# Altium schematic sheet [1]_Power.SchDoc
size A; SheetNumber: 1; SheetTotal: 3
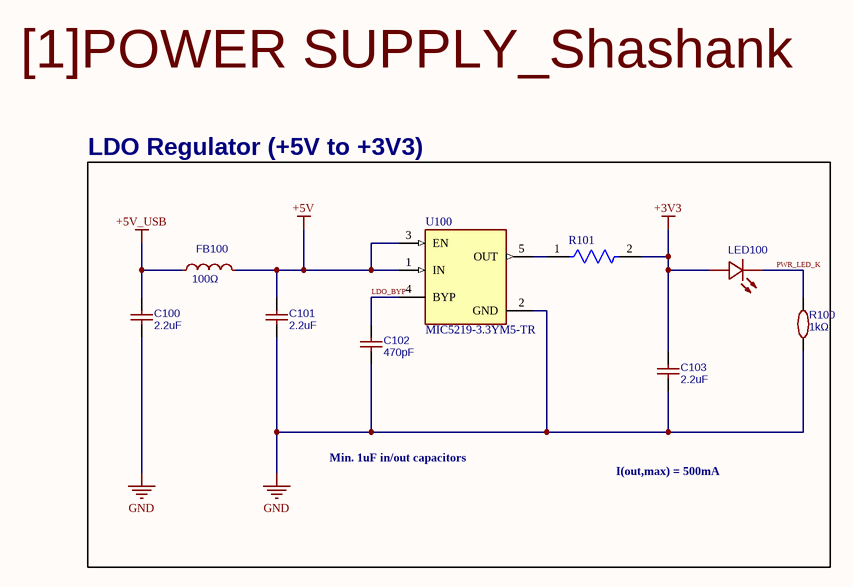
[diagram p0: [1]_Power.SchDoc]

## Parts
C100  2.2uF  [C0603]
C101  2.2uF  [C0603]
C102  470pF  [C0402]
C103  2.2uF  [C0603]
FB100  100Ω  [L0603]
LED100  FC-F1005UGK-520M5  [LED0402-RD]  (value not drawn)
R100  1kΩ  [R0402]
R101  CRCW04020000Z0ED  [FP-CRCW0402-e3-IPC_C]  (value not drawn)
U100  MIC5219-3.3YM5-TR  [FP-SOT23-5LD-PL-1-IPC_C]

## Nets
+3V3: C103.2 LED100.2(A) R101.2
+5V: C101.2 FB100.2 U100.1(IN) U100.3(EN)
+5V_USB: C100.2 FB100.1
GND: C100.1 C101.1 C102.1 C103.1 R100.1 U100.2(GND)
LDO_BYP: C102.2 U100.4(BYP)
PWR_LED_K: LED100.1(K) R100.2
NetR101_1: R101.1 U100.5(OUT)

## Notes on the sheet
- [1]POWER SUPPLY_Shashank
- LDO Regulator (+5V to +3V3)
- Min. 1uF in/out capacitors
- I(out,max) = 500mA

## Library data of the parts
C100 C101 C103 = 2.2uF: Manufacturer Part: CL10A225KO8NNNC; Manufacturer: SAMSUNG(三星); nameAlias: Value; Supplier: LCSC; Supplier Part: C23630; JLCPCB Part Class: Basic Part; link: https://lcsc.com/eda_search?q=C23630&%26type=1&ref=editor; spicePre: C; spiceSymbolName: CL10A225KO8NNNC
C102 = 470pF: Manufacturer: FH(风华); Manufacturer Part: 0402B471K500NT; nameAlias: Value; Supplier: LCSC; Supplier Part: C1537; JLCPCB Part Class: Basic Part; link: https://lcsc.com/eda_search?q=C1537&%26type=1&ref=editor; spicePre: C; spiceSymbolName: 0402B471K500NT
FB100 = 120Ω: Manufacturer: Sunlord(顺络); Manufacturer Part: PZ1608D121-2R0TF; nameAlias: Value; Supplier: LCSC; Supplier Part: C42102; JLCPCB Part Class: Extended Part; spicePre: L; spiceSymbolName: PZ1608D121-2R0TF
LED100 = FC-F1005UGK-520M5: Manufacturer: 国星光电; Manufacturer Part: NCD0402G1; Contributor: LCSC; Supplier: LCSC; Supplier Part: C130723; JLCPCB Part Class: Extended Part; link: https://lcsc.com/eda_search?q=C130723&%26type=1&ref=editor; spicePre: L; spiceSymbolName: FC-F1005UGK-520M5
R100 = 1kΩ: Manufacturer: UNI-ROYAL(厚声); Manufacturer Part: 0402WGF1001TCE; nameAlias: Value; Supplier: LCSC; Supplier Part: C11702; JLCPCB Part Class: Basic Part; link: https://lcsc.com/eda_search?q=C11702&%26type=1&ref=editor; spicePre: R; spiceSymbolName: 0402WGF1001TCE
R101 = CMP-2002-08122-2: RES Thick Film, 0Ω, 0.063W, 0402; Tolerance: 5%; Max Power Dissipation: 63mW; Voltage Rating: 50V; Temperature Coefficient: 100ppm/°C; Resistance: 0mR; Contact Plating: Tin; Height: 0.35mm; Radiation Hardening: No; Features: Automotive AEC-Q200; Composition: Thick Film; Width: 0.5mm; Weight: 2.3E-05oz; Termination: SMD/SMT; Packaging: Tape and Reel; Mount: Surface Mount; Case Code (Metric): 1005; Military Standard: Not; Min Operating Temperature: -55°C; Number of Terminations: 2; Package Quantity: 1; Case Code (Imperial): 0402; Depth: 0.5mm; Max Operating Temperature: 155°C; Case/Package: 0402; Power Rating: 63mW; Lead Free: Lead Free; Voltage Rating (DC): 50V; Length: 1mm
U100 = CMP-06324-000027-1: IC REG LINEAR 3.3V 500MA SOT23-5; Dropout Voltage: 350mV; Output Type: Fixed; Number of Regulators: 1; Max Input Voltage: 12V; Min Input Voltage: 2.5V; Min Operating Temperature: -40°C; Nominal Output Voltage: 3.3V; Output Voltage: 3.3V; Packaging: Cut Tape; Mount: Surface Mount; Number of Pins: 5; Case/Package: SOT-23-5; Lead Free: Lead Free; Max Operating Temperature: 125°C; REACH SVHC: No SVHC; Output Current: 500mA